# EAGLE design AccessControlBoard (EAGLE 9.0.1)
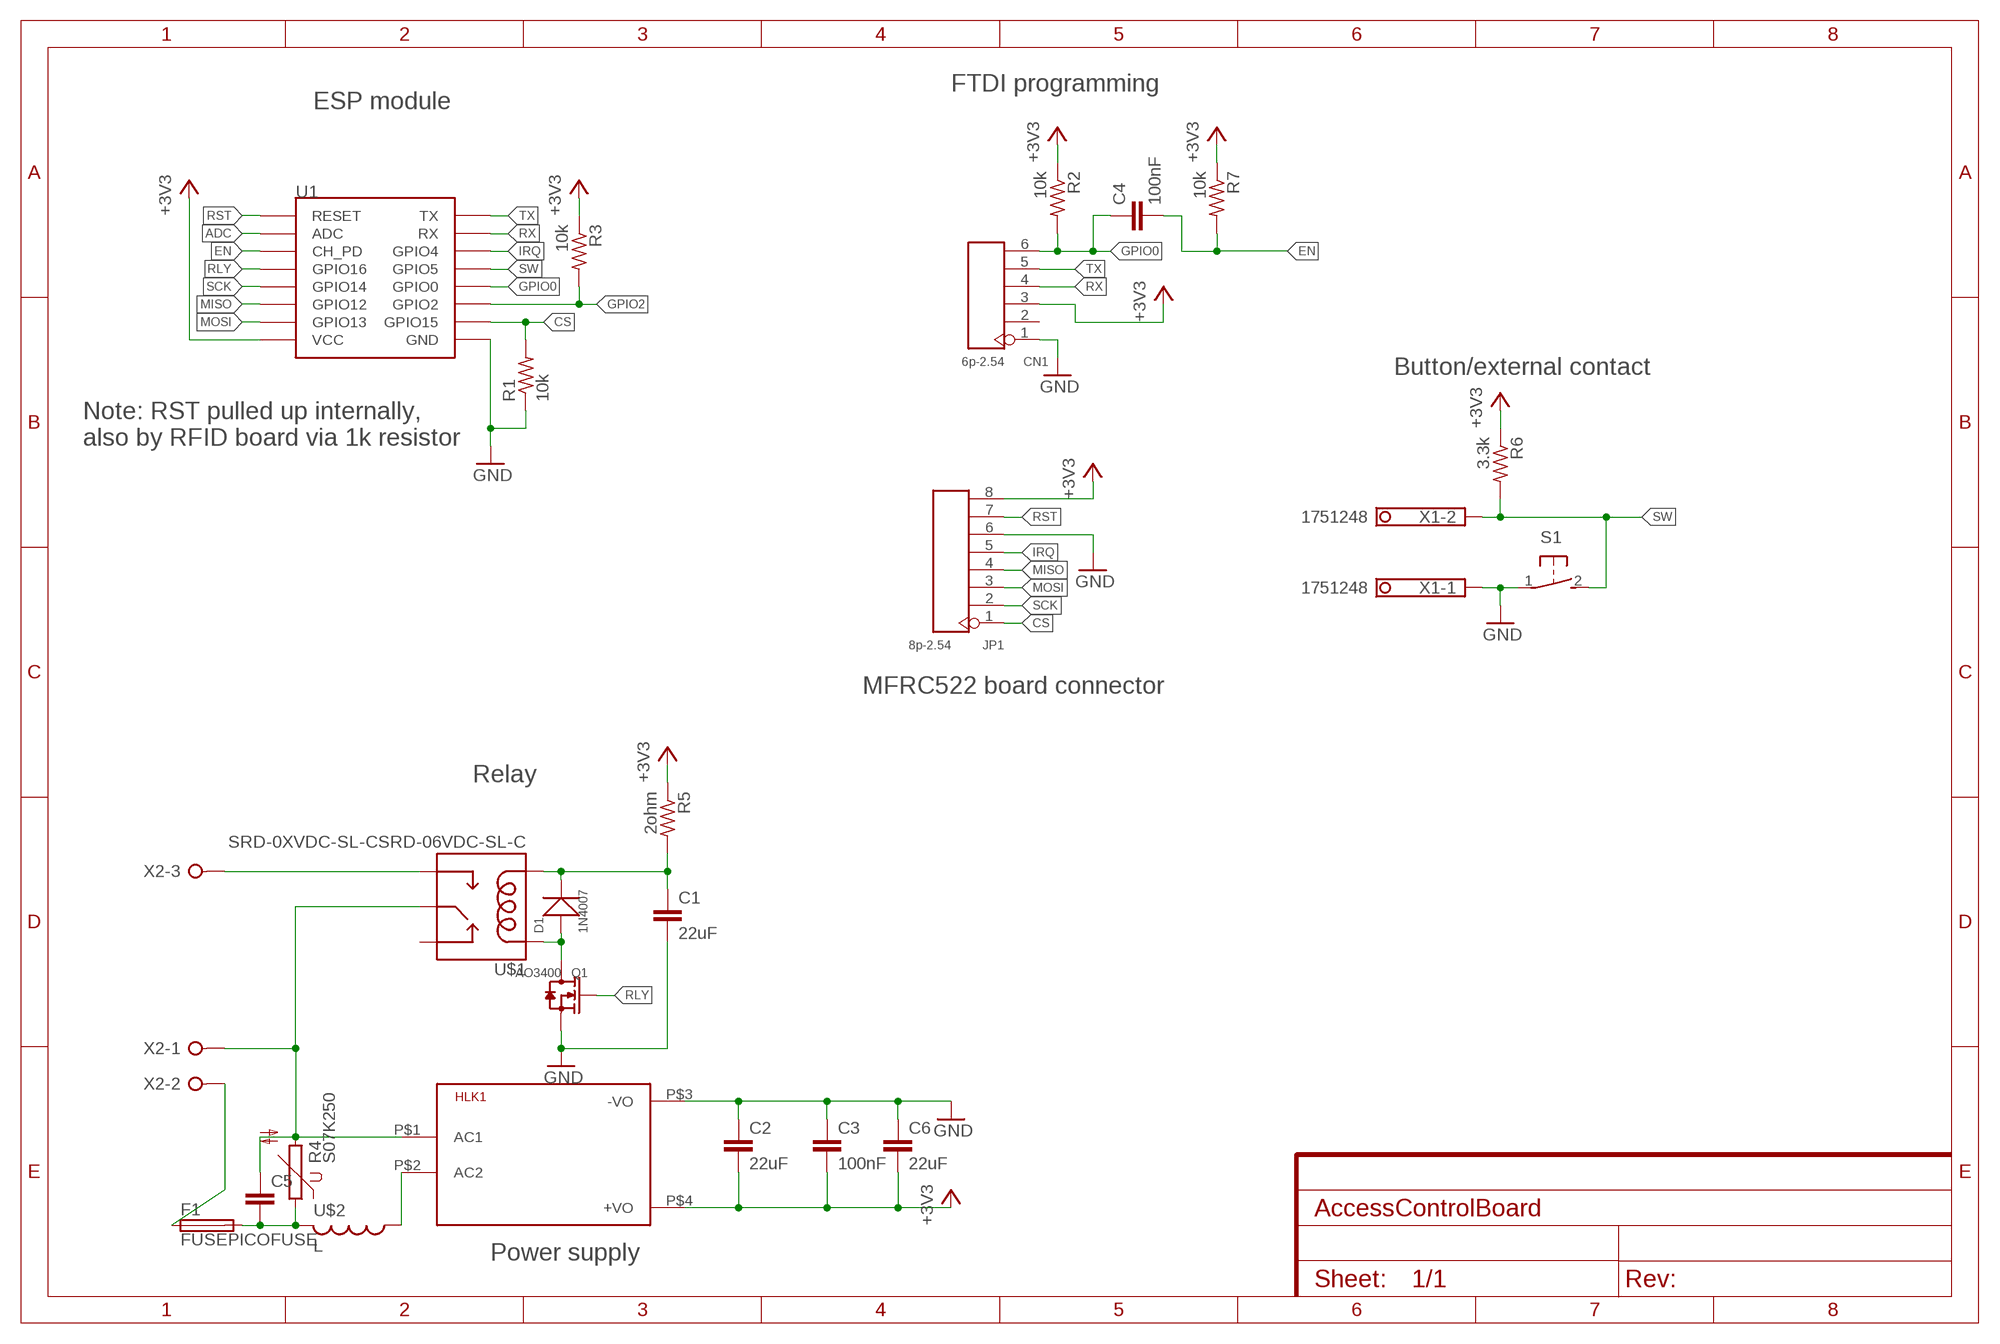
[diagram p0: schematic, sheet 1]

## Parts
C1  22uF  C-EUC0805K  [C0805K]
C2  22uF  C-EUC0805K  [C0805K]
C3  100nF  C-EUC0603K  [C0603K]
C4  100nF  C-EUC0603K  [C0603K]
C5  C-EU102-064X133  [C102-064X133]
C6  22uF  C-EUC0805K  [C0805K]
CN1  6p-2.54  DIP-BLACK-FEMALE-HEADER-VERT(6P-2.54)  [H6-2.54]
D1  1N4007  DIODE-GEN-PURPOSE-1KV-1A(DO-214AC)  [DO-214AC]
F1  FUSEPICOFUSE  [PICOFUSE]
HLK1  HLK-PM013W  [HLK-PM01]
JP1  8p-2.54  DIP-BLACK-MALE-HEADER-VERT(8P-2.54)  [H8-2.54]
Q1  AO3400  SMD-MOSFET-N-CH-60V-300MA-LOGIC-LEVEL-FET-2N7002(SOT-23)  [SOT-23]
R1  10k  R-US_R0603  [R0603]
R2  10k  R-US_R0603  [R0603]
R3  10k  R-US_R0603  [R0603]
R4  S07K250  [S07K250]
R5  2ohm  R-US_R0603  [R0603]
R6  3.3k  R-US_R0603  [R0603]
R7  10k  R-US_R0603  [R0603]
S1  31-XX  [B3F-31XX]
U1  ESP12SMD  [ESP12-SMD]
U$1  SRD-0XVDC-SL-CSRD-06VDC-SL-C  [SRD-0XVDC-SL-C]
U$2  L  [6000]
X1  1751248  [1751248]
X2  W237-3E  [W237-3E]

## Nets
+3V3: C2.2 C3.2 C6.2 CN1.3 HLK1.P$4(+VO) JP1.8 R2.1 R3.1 R5.1 R6.1 R7.1 U1.VCC
ADC: U1.ADC
CS: JP1.1 R1.2 U1.GPIO15
EN: C4.2 R7.2 U1.CH_PD
GND: C1.2 C2.1 C3.1 C6.1 CN1.1 HLK1.P$3(-VO) JP1.6 Q1.2(S) R1.1 S1.1(P) U1.GND X1.1
GPIO0: C4.1 CN1.6 R2.2 U1.GPIO0
GPIO2: R3.2 U1.GPIO2
IRQ: JP1.5 U1.GPIO4
MISO: JP1.4 U1.GPIO12
MOSI: JP1.3 U1.GPIO13
N$1: U$1.SWOPEN X2.3
N$2: C5.1 HLK1.P$1(AC1) R4.2 U$1.SWCOMMON X2.1
N$3: C5.2 F1.2 R4.1 U$2.2
N$4: F1.1 X2.2
N$5: C1.1 D1.2(-) R5.2 U$1.COIL0
N$6: HLK1.P$2(AC2) U$2.1
N$8: D1.1(+) Q1.3(D) U$1.COIL1
RLY: Q1.1(G) U1.GPIO16
RST: JP1.7 U1.RESET
RX: CN1.4 U1.RXD0(RX)
SCK: JP1.2 U1.GPIO14
SW: R6.2 S1.2(S) U1.GPIO5 X1.2
TX: CN1.5 U1.TXD0(TX)
Unconnected: CN1.2 U$1.SWCLOSED(SWCLOSE)

## Notes on the sheet
- FTDI programming
- ESP module
- Button/external contact
- Note: RST pulled up internally,
  also by RFID board via 1k resistor
- MFRC522 board connector
- Relay
- Power supply

## Library data of the parts
C1-C6 = rcl:C-EU: CAPACITOR, European symbol; SPICEPREFIX: C
CN1 = Seeed-Connector:DIP-BLACK-FEMALE-HEADER-VERT(6P-2.54): 320030060; MPN: F185-1106A1BSYC1
D1 = Seeed-Diode:DIODE-GEN-PURPOSE-1KV-1A(DO-214AC): 304010013; MPN: 1N4007
F1 = fuse:FUSE: Fuse; OC_FARNELL: unknown; OC_NEWARK: unknown
HLK1 = HLK-PM01:HLK-PM01: Hi-Link Power Supply HLK-PM01 3W Author: Ahmed Said <https://github.com/AhmedSaid/EAGLELibraries>
JP1 = Seeed-Connector:DIP-BLACK-MALE-HEADER-VERT(8P-2.54): 320020080; MPN: P125-1108A1BS116A1
Q1 = Seeed-Transistor:SMD-MOSFET-N-CH-60V-300MA-LOGIC-LEVEL-FET-2N7002(SOT-23): 305030028; MPN: 2N7002,215; VALUE: 2N7002
R1-R3 R5-R7 = resistor:R-US_: RESISTOR, American symbol
R4 = varistor:S07K250: VARISTOR
S1 = switch-omron:31-XX: OMRON SWITCH; MPN: B3F-3100; OC_FARNELL: 959704; OC_NEWARK: 36M3582
U1 = esp8266modules:ESP12: ESP8266 Wifi module 12
U$1 = SRD-0XVDC-SL-C:SRD-0XVDC-SL-C: SRD-05VDC-SL-C SRD-06VDC-SL-C Compatible with: SONGLE Relays SHUN YU JQX-3F other same relays Author: Ahmed Said <https://github.com/AhmedSaid/EAGLELibraries>
U$2 = adafruit:L
X1 = con-phoenix-350:1751248: MKDS 1/ 2-3,5 Printklemme Nennstrom: 10 A Bemessungsspannung: 160 V Raster: 3,5 mm Polzahl: 2 Montageart: Löten Anschlussart: Schraubanschluss Anschlussrichtung vom Leiter zur Platine: 0° Source: http://eshop.phoenixcontact.com .. 1751248.pdf; OC_FARNELL: unknown; OC_NEWARK: unknown
X2 = con-wago-508:W237-3E: WAGO SREW CLAMP; OC_FARNELL: unknown; OC_NEWARK: unknown

## Board
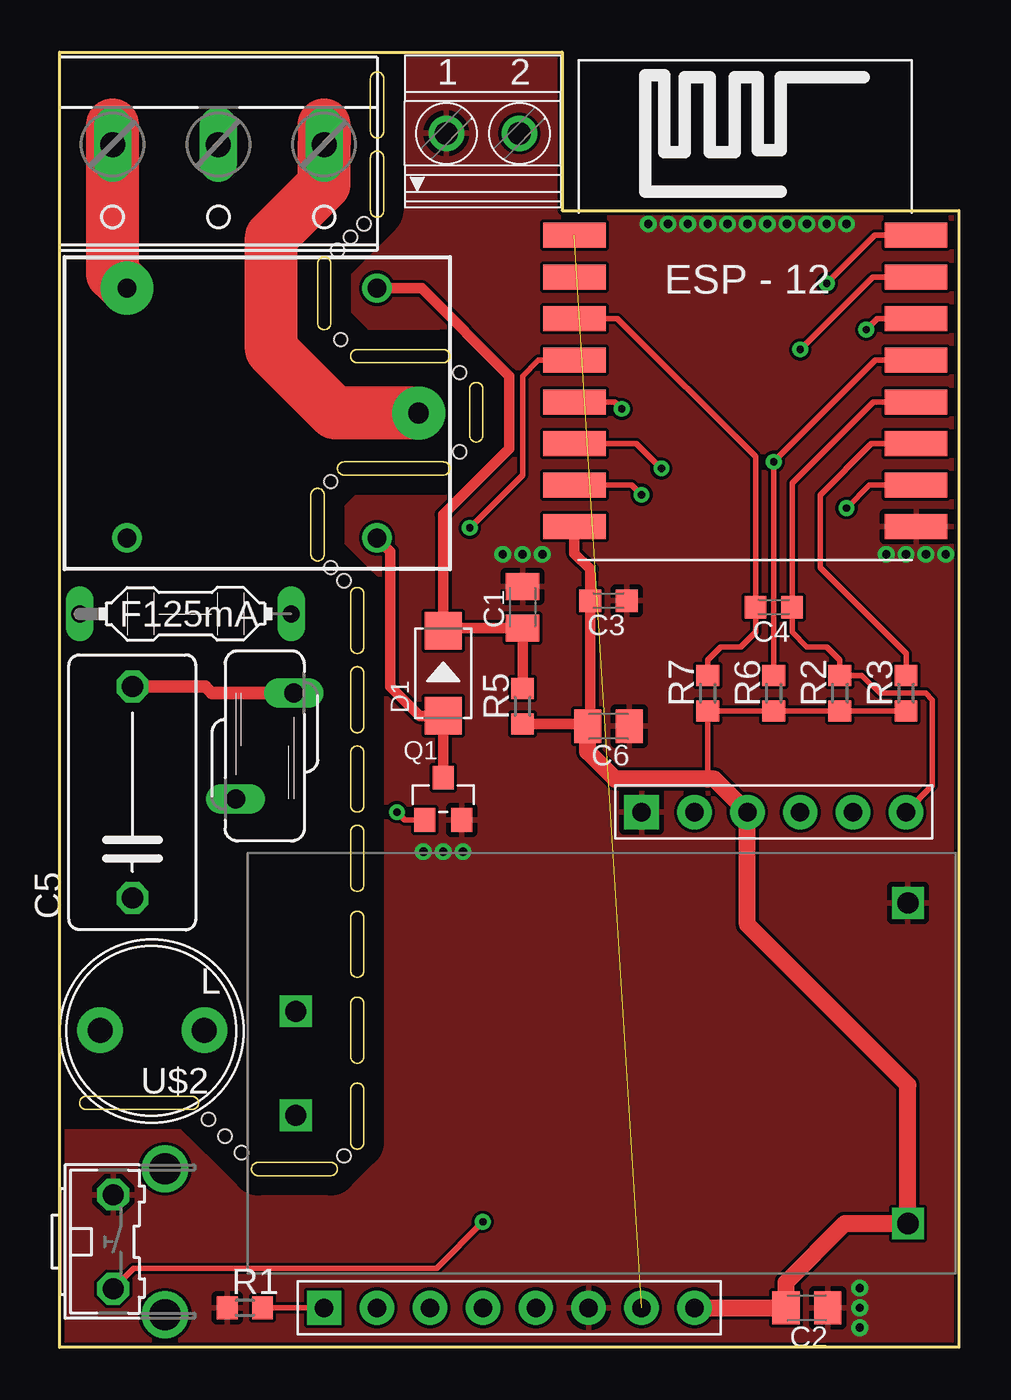
[diagram p1: board, top side]
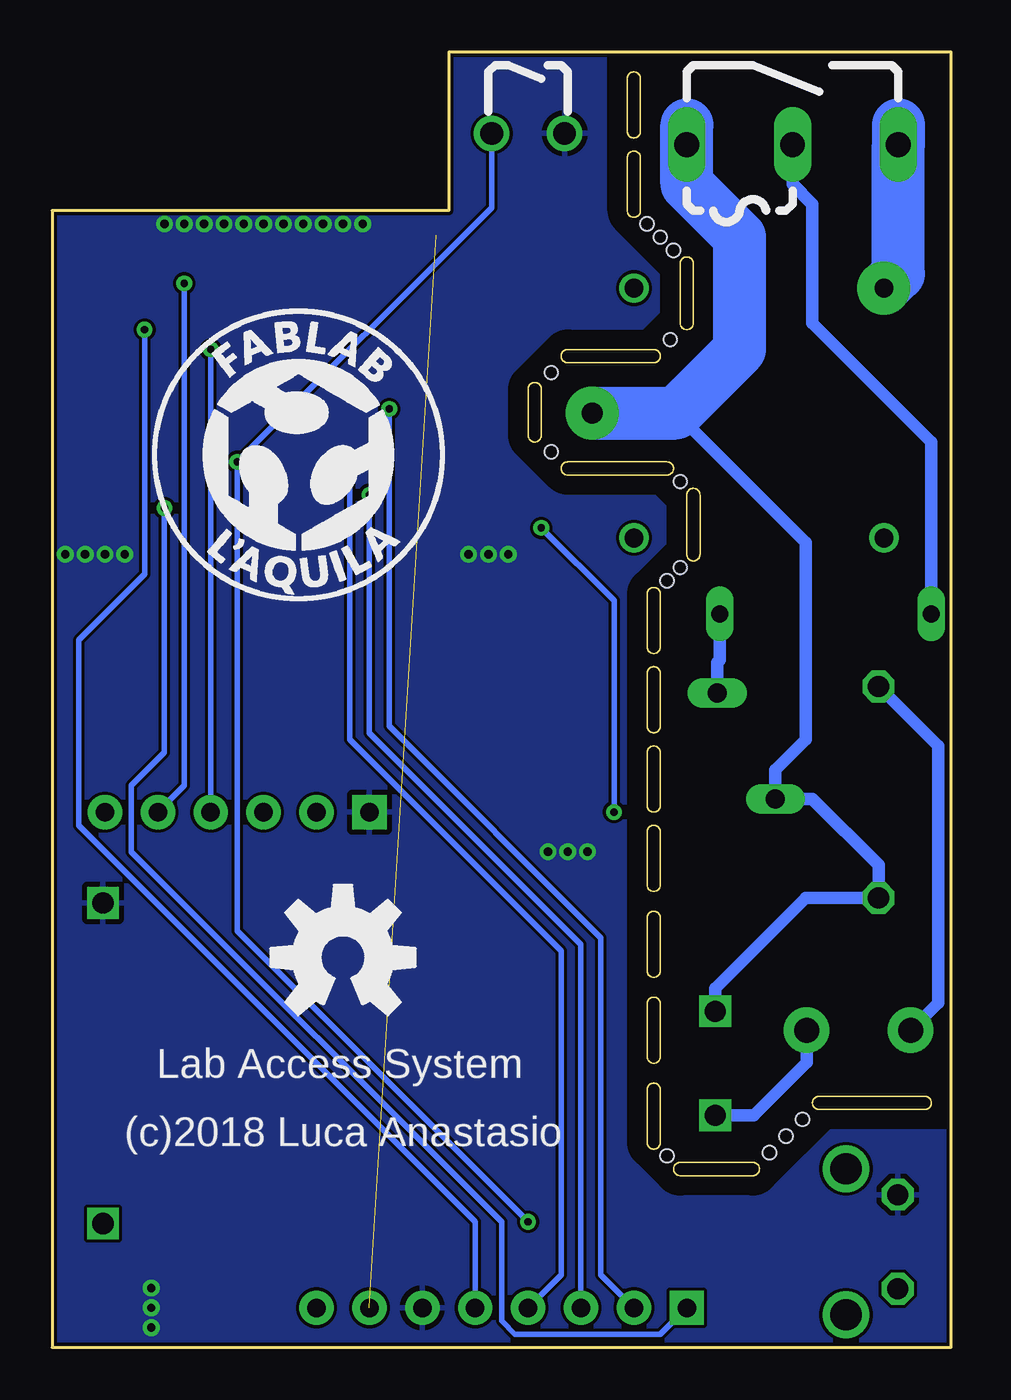
[diagram p2: board, bottom side, seen from below]

Size 43.18 x 62.23 mm. Coordinates in mm from the lower left corner, seen from the top.
Outline: 0,0 0,62.23 24.13,62.23 24.13,54.61 43.18,54.61 43.18,0 0,0
Outline: 12.7,52.39 arc90 12.38,52.07 12.38,49.21 arc90 12.7,48.9 arc90 13.02,49.21 13.02,52.07 arc90 12.7,52.39
Outline: 15.24,57.47 arc90 14.92,57.15 14.92,54.61 arc90 15.24,54.29 arc90 15.56,54.61 15.56,57.15 arc90 15.24,57.47
Outline: 15.24,61.28 arc90 14.92,60.96 14.92,58.42 arc90 15.24,58.1 arc90 15.56,58.42 15.56,60.96 arc90 15.24,61.28
Outline: 14.29,36.51 arc90 13.97,36.2 13.97,33.66 arc90 14.29,33.34 arc90 14.61,33.66 14.61,36.2 arc90 14.29,36.51
Outline: 12.38,41.27 arc90 12.06,40.96 12.06,38.1 arc90 12.38,37.78 arc90 12.7,38.1 12.7,40.96 arc90 12.38,41.27
Outline: 13.97,47.62 arc90 14.29,47.31 18.41,47.31 arc90 18.73,47.62 arc90 18.41,47.94 14.29,47.94 arc90 13.97,47.62
Outline: 13.34,42.23 arc90 13.65,41.91 18.41,41.91 arc90 18.73,42.23 arc90 18.41,42.55 13.65,42.55 arc90 13.34,42.23
Outline: 20,46.35 arc90 19.68,46.04 19.68,43.81 arc90 20,43.5 arc90 20.32,43.81 20.32,46.04 arc90 20,46.35
Outline: 14.29,32.7 arc90 13.97,32.38 13.97,29.84 arc90 14.29,29.53 arc90 14.61,29.84 14.61,32.38 arc90 14.29,32.7
Outline: 14.29,28.89 arc90 13.97,28.57 13.97,26.04 arc90 14.29,25.72 arc90 14.61,26.04 14.61,28.57 arc90 14.29,28.89
Outline: 14.29,25.08 arc90 13.97,24.77 13.97,22.23 arc90 14.29,21.91 arc90 14.61,22.23 14.61,24.77 arc90 14.29,25.08
Outline: 14.29,20.95 arc90 13.97,20.64 13.97,18.1 arc90 14.29,17.78 arc90 14.61,18.1 14.61,20.64 arc90 14.29,20.95
Outline: 14.29,16.83 arc90 13.97,16.51 13.97,13.97 arc90 14.29,13.65 arc90 14.61,13.97 14.61,16.51 arc90 14.29,16.83
Outline: 14.29,12.7 arc90 13.97,12.38 13.97,9.84 arc90 14.29,9.53 arc90 14.61,9.84 14.61,12.38 arc90 14.29,12.7
Outline: 0.95,11.75 arc90 1.27,11.43 6.35,11.43 arc90 6.67,11.75 arc90 6.35,12.06 1.27,12.06 arc90 0.95,11.75
Outline: 9.21,8.57 arc90 9.53,8.26 13.02,8.26 arc90 13.34,8.57 arc90 13.02,8.89 9.53,8.89 arc90 9.21,8.57
Copper layers (1*16): Top 0.035mm / dielectric 1.5mm / Bottom 0.035mm
Design rules "default *": minimum track width 6mil, minimum drill 0.35mm, track to track 6mil, track to pad 6mil, pad to pad 6mil, via to via 6mil, smd to smd 6mil, copper to edge 6mil, drill to drill 6mil, minimum pad ring 10mil, minimum via ring 8mil, stop-mask expansion 4mil, vias tented up to drill 20mil, thermal gap 10mil
Holes 0.64 mm at 13.97,53.34 13.34,52.7 14.61,53.98 13.49,48.42 19.21,46.83 19.21,43.02 13.02,41.59 13.02,37.47 13.65,36.83 13.65,9.21 7.94,10.16 7.14,10.95 8.73,9.37
tRestrict: 17 lines
bRestrict: 17 lines

### Footprints (pad centres in the part's own frame; a part is rotated, then mirrored left to right if it is on the bottom)
C0805K = smd 1.3 x 1.6: 1 -1,0; 2 1,0
C0603K = smd 1.05 x 1.08: 1 -0.875,0; 2 0.875,0
C102-064X133 = drill 1.016 octagon: 1 -5.08,0; 2 5.08,0
H6-2.54 = drill 0.889 pad 1.651 square: 1 0,6.35 | drill 0.889 pad 1.651: 2 0,3.81; 3 0,1.27; 4 0,-1.27; 5 0,-3.81; 6 0,-6.35
DO-214AC = smd 1.8 x 1.77: 1 -2.042,0; 2 2.042,0
PICOFUSE = drill 0.813 long: 1 -5.08,0; 2 5.08,0
HLK-PM01 = drill 1.016 square: P$1 -14.7,2.5; P$2 -14.7,-2.5; P$3 14.7,7.7; P$4 14.7,-7.7
H8-2.54 = drill 0.889 pad 1.651 square: 1 0,8.89 | drill 0.889 pad 1.651: 2 0,6.35; 3 0,3.81; 4 0,1.27; 5 0,-1.27; 6 0,-3.81; 7 0,-6.35; 8 0,-8.89
SOT-23 = smd 1.016 x 1.143: 1 -0.889,-1.016; 2 0.889,-1.016; 3 0,1.016
R0603 = smd 1 x 1.1: 1 -0.85,0; 2 0.85,0
S07K250 = drill 0.914 long: 1 -1.397,-2.54; 2 1.397,2.54
B3F-31XX = drill 1.016 octagon: 1 -2.261,-1.245; 2 2.261,-1.245 | drill 1.499 pad 2.159: 3 -3.505,1.245; 4 3.505,1.245
ESP12-SMD = smd 3 x 1.2: ADC -8.3,3.8; CH_PD -8.3,1.8; GND 8.1,-8.2; GPIO0 8.1,-2.2; GPIO2 8.1,-4.2; GPIO4 8.1,1.8; GPIO5 8.1,-0.2; GPIO12 -8.3,-4.2; GPIO13 -8.3,-6.2; GPIO14 -8.3,-2.2; GPIO15 8.1,-6.2; GPIO16 -8.3,-0.2; RESET -8.3,5.8; RXD0 8.1,3.8; TXD0 8.1,5.8; VCC -8.3,-8.2
SRD-0XVDC-SL-C = drill 0.9: COIL0 -5.39,-6.12; COIL1 -5.39,5.88; SWCLOSED 6.61,5.88 | drill 1 pad 2.54: SWCOMMON -7.39,-0.12 | drill 0.9 pad 2.54: SWOPEN 6.61,-6.12
6000 = drill 1.2 pad 2.184: 1 -2.5,0; 2 2.5,0
1751248 = drill 1.1 pad 1.7: 1 -1.75,-0.1; 2 1.75,-0.1
W237-3E = drill 1.194 long: 1 -5.08,-0.635; 2 0,-0.635; 3 5.08,-0.635

### Placement (x,y rotation side)
C1  22.23,35.56 90 top
C2  35.88,1.91 180 top
C3  26.35,35.88 180 top
C4  34.29,35.56 180 top
C5  3.49,26.67 90 top
C6  26.35,29.84 180 top
CN1  34.29,25.72 90 top
D1  18.41,32.38 90 top
F1  6.03,35.24 0 top
HLK1  26.04,13.65 0 top
JP1  21.59,1.91 90 top
Q1  18.41,26.35 0 top
R1  8.89,1.91 0 top
R2  37.47,31.43 90 top
R3  40.64,31.43 90 top
R4  9.84,28.89 180 top
R5  22.23,30.8 90 top
R6  34.29,31.43 90 top
R7  31.11,31.43 90 top
S1  3.81,5.08 270 top
U1  33.02,47.62 0 top
U$1  9.84,44.77 180 top
U$2  4.45,15.24 180 top
U$3  [OSHW-LOGO-L]  29.21,18.73 0 bottom
X1  20.32,58.42 0 top
X2  7.62,57.15 180 top

### Tracks (layer width: path | path; a pad name or v marks a point on that pad's centre or on a via)
+3V3
  Top 0.254: 31.11,27.3 R7.1 R6.1 R2.1 R3.1
  Top 0.508: R5.1 25.25,29.95 C6.2 25.48,29.97 C3.2 25.48,37.39 24.72,38.15 U1.VCC
  Top 0.813: JP1.8 C2.2 34.88,3.13 37.7,5.95 HLK1.P$4 40.73,12.61 33.02,20.32 CN1.3 31.43,27.3 31.11,27.3 26.67,27.3 25.35,28.62 C6.2
CS  (via drill 0.35)
  Top 0.254: R1.2 JP1.1 | U1.GPIO15 38.88,41.42 v37.78,40.32
  Bottom 0.254: JP1.1 13.97,0.64 20.95,0.64 21.59,1.27 21.59,6.03 39.37,23.81 39.37,26.99 37.78,28.57 v37.78,40.32
EN
  Top 0.254: R7.2 31.11,33.02 31.75,33.66 32.7,33.66 33.41,34.37 C4.2 33.41,42.78 26.77,49.42 U1.CH_PD
GND  (via drill 0.4)
  other vias: 38.42,2.86 42.55,38.1 41.59,38.1 40.64,38.1 39.69,38.1 22.23,38.1 21.27,38.1 23.18,38.1 30.16,53.98 17.46,23.81 18.41,23.81 19.37,23.81 31.11,53.98 38.42,1.91 38.42,0.95 33.02,53.98 32.07,53.98 33.97,53.98 34.92,53.98 35.88,53.98 36.83,53.98 37.78,53.98 29.21,53.98 28.26,53.98
  pour Top: 0,0 0,10.48 5.71,10.48 8.89,7.3 13.65,7.3 15.56,9.21 15.56,36.83 13.65,38.73 13.65,40.32 14.29,40.96 19.05,40.96 21.27,43.18 21.27,46.67 19.05,48.9 14.92,48.9 13.97,49.85 13.97,51.44 16.51,53.98 16.51,62.23 24.13,62.23 24.13,54.61 43.18,54.61 43.18,0
  pour Bottom: 16.51,62.23 24.13,62.23 24.13,54.61 43.18,54.61 43.18,0 0,0 0,10.48 5.71,10.48 8.89,7.3 13.65,7.3 15.56,9.21 15.56,36.83 13.65,38.73 13.65,40.32 14.29,40.96 19.05,40.96 21.27,43.18 21.27,46.67 19.05,48.9 14.92,48.9 13.97,49.85 13.97,51.44 16.51,53.98
GPIO0
  Top 0.254: U1.GPIO0 39.08,45.42 35.16,41.52 C4.1 35.16,34.37 35.88,33.66 36.83,33.66 37.47,33.02 R2.2 38.52,32.28 39.37,31.43 41.59,31.43 41.91,31.11 41.91,26.99 CN1.6
GPIO2
  Top 0.254: U1.GPIO2 38.98,43.42 36.51,40.96 36.51,37.47 40.64,33.34 R3.2
IRQ  (via drill 0.35)
  Top 0.254: v38.73,48.9 39.27,49.42 U1.GPIO4
  Bottom 0.254: JP1.5 22.86,6.03 41.91,25.08 41.91,33.97 38.73,37.15 v38.73,48.9
MISO  (via drill 0.35)
  Top 0.254: v28.89,42.23 27.7,43.42 U1.GPIO12
  Bottom 0.254: JP1.4 18.73,3.49 18.73,19.05 28.89,29.21 v28.89,42.23
MOSI  (via drill 0.35)
  Top 0.254: v27.94,40.96 27.47,41.42 U1.GPIO13
  Bottom 0.254: v27.94,40.96 27.94,29.53 17.78,19.37 JP1.3
N$1
  Top 2.54: U$1.SWOPEN 2.54,51.58 2.54,58.74
  Bottom 2.54: U$1.SWOPEN 2.54,51.58 X2.3 2.54,58.74
N$2
  Top 2.54: U$1.SWCOMMON 13.21,44.89 10.16,47.94 10.16,53.34 12.7,55.88 X2.1 12.7,58.74
  Bottom 0.61: HLK1.P$1 11.34,17.24 6.99,21.59 C5.1 3.49,23.18 6.67,26.35 R4.2 8.45,27.75 6.99,29.21 6.99,38.66 13.21,44.89
  Bottom 2.54: U$1.SWCOMMON 13.21,44.89 10.16,47.94 10.16,53.34 12.7,55.88 12.7,58.74
N$3
  Top 0.61: C5.2 6.99,31.75 7.3,31.43 R4.1
  Bottom 0.61: C5.2 0.64,28.89 0.64,16.55 U$2.2 | F1.2 11.11,33.02 11.24,32.89 R4.1
N$4
  Bottom 0.61: X2.2 7.62,55.88 6.67,54.93 6.67,49.21 0.95,43.5 F1.1
N$5
  Top 0.508: U$1.COIL0 17.38,50.89 21.59,46.67 21.59,43.18 18.41,40.01 D1.2 18.55,34.56 C1.1 R5.2
N$6
  Bottom 0.61: HLK1.P$2 9.48,11.15 6.95,13.69 U$2.1
N$8
  Top 0.508: U$1.COIL1 15.88,38.24 15.88,31.75 17.28,30.34 D1.1 Q1.3
RLY  (via drill 0.35)
  Top 0.254: U1.GPIO16 22.98,47.42 22.23,46.67 22.23,41.91 v19.68,39.37 | 17.46,25.4 Q1.1 16.57,25.34 v16.19,25.72
  Bottom 0.254: v19.68,39.37 16.19,35.88 v16.19,25.72
RST  (1 unrouted)
RX  (via drill 0.35)
  Top 0.254: v35.56,47.94 39.04,51.42 U1.RXD0
  Bottom 0.254: CN1.4 v35.56,47.94
SCK  (via drill 0.35)
  Top 0.254: U1.GPIO14 26.65,45.42 v26.99,45.09
  Bottom 0.254: JP1.2 16.83,3.49 16.83,19.68 26.99,29.84 v26.99,45.09
SW  (via drill 0.35)
  Top 0.254: S1.2 3.56,3.81 18.1,3.81 v20.32,6.03 | R6.2 v34.29,42.55 39.17,47.42 U1.GPIO5
  Bottom 0.254: v20.32,6.03 34.29,20 v34.29,42.55 22.07,54.77 X1.2
TX  (via drill 0.35)
  Top 0.254: v36.83,51.12 39.14,53.42 U1.TXD0
  Bottom 0.254: CN1.5 36.83,26.99 v36.83,51.12

### Text on the board
tPlace: F125mA
bPlace: Lab Access System | (c)2018 Luca Anastasio